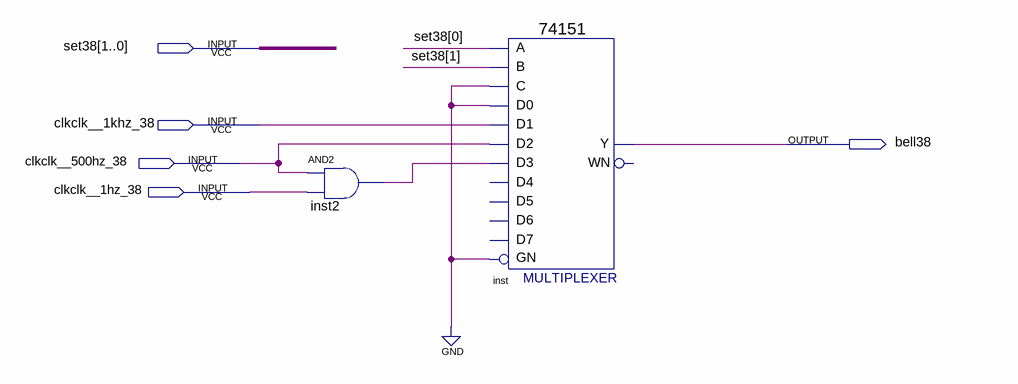
[diagram p0: schematic sheet]
// Quartus schematic mux3_38.bdf as structural Verilog: 2 symbols, 5 pins
module mux3_38 (
  input  [1:0] set38,
  input  clkclk__1khz_38,
  input  clkclk__500hz_38,
  input  clkclk__1hz_38,
  output bell38
);

  wire inst2_out;

  and inst2 (inst2_out, clkclk__500hz_38, clkclk__1hz_38);
  \74151  inst (
    .GN(1'b0), .C(1'b0), .B(set38[1]), .A(set38[0]), .D0(1'b0), .D1(clkclk__1khz_38), .D3(inst2_out),
    .D2(clkclk__500hz_38), .Y(bell38));  // open: D5, D4, D6, D7, WN
endmodule
